# Altium project LM-002-C.PrjPcb
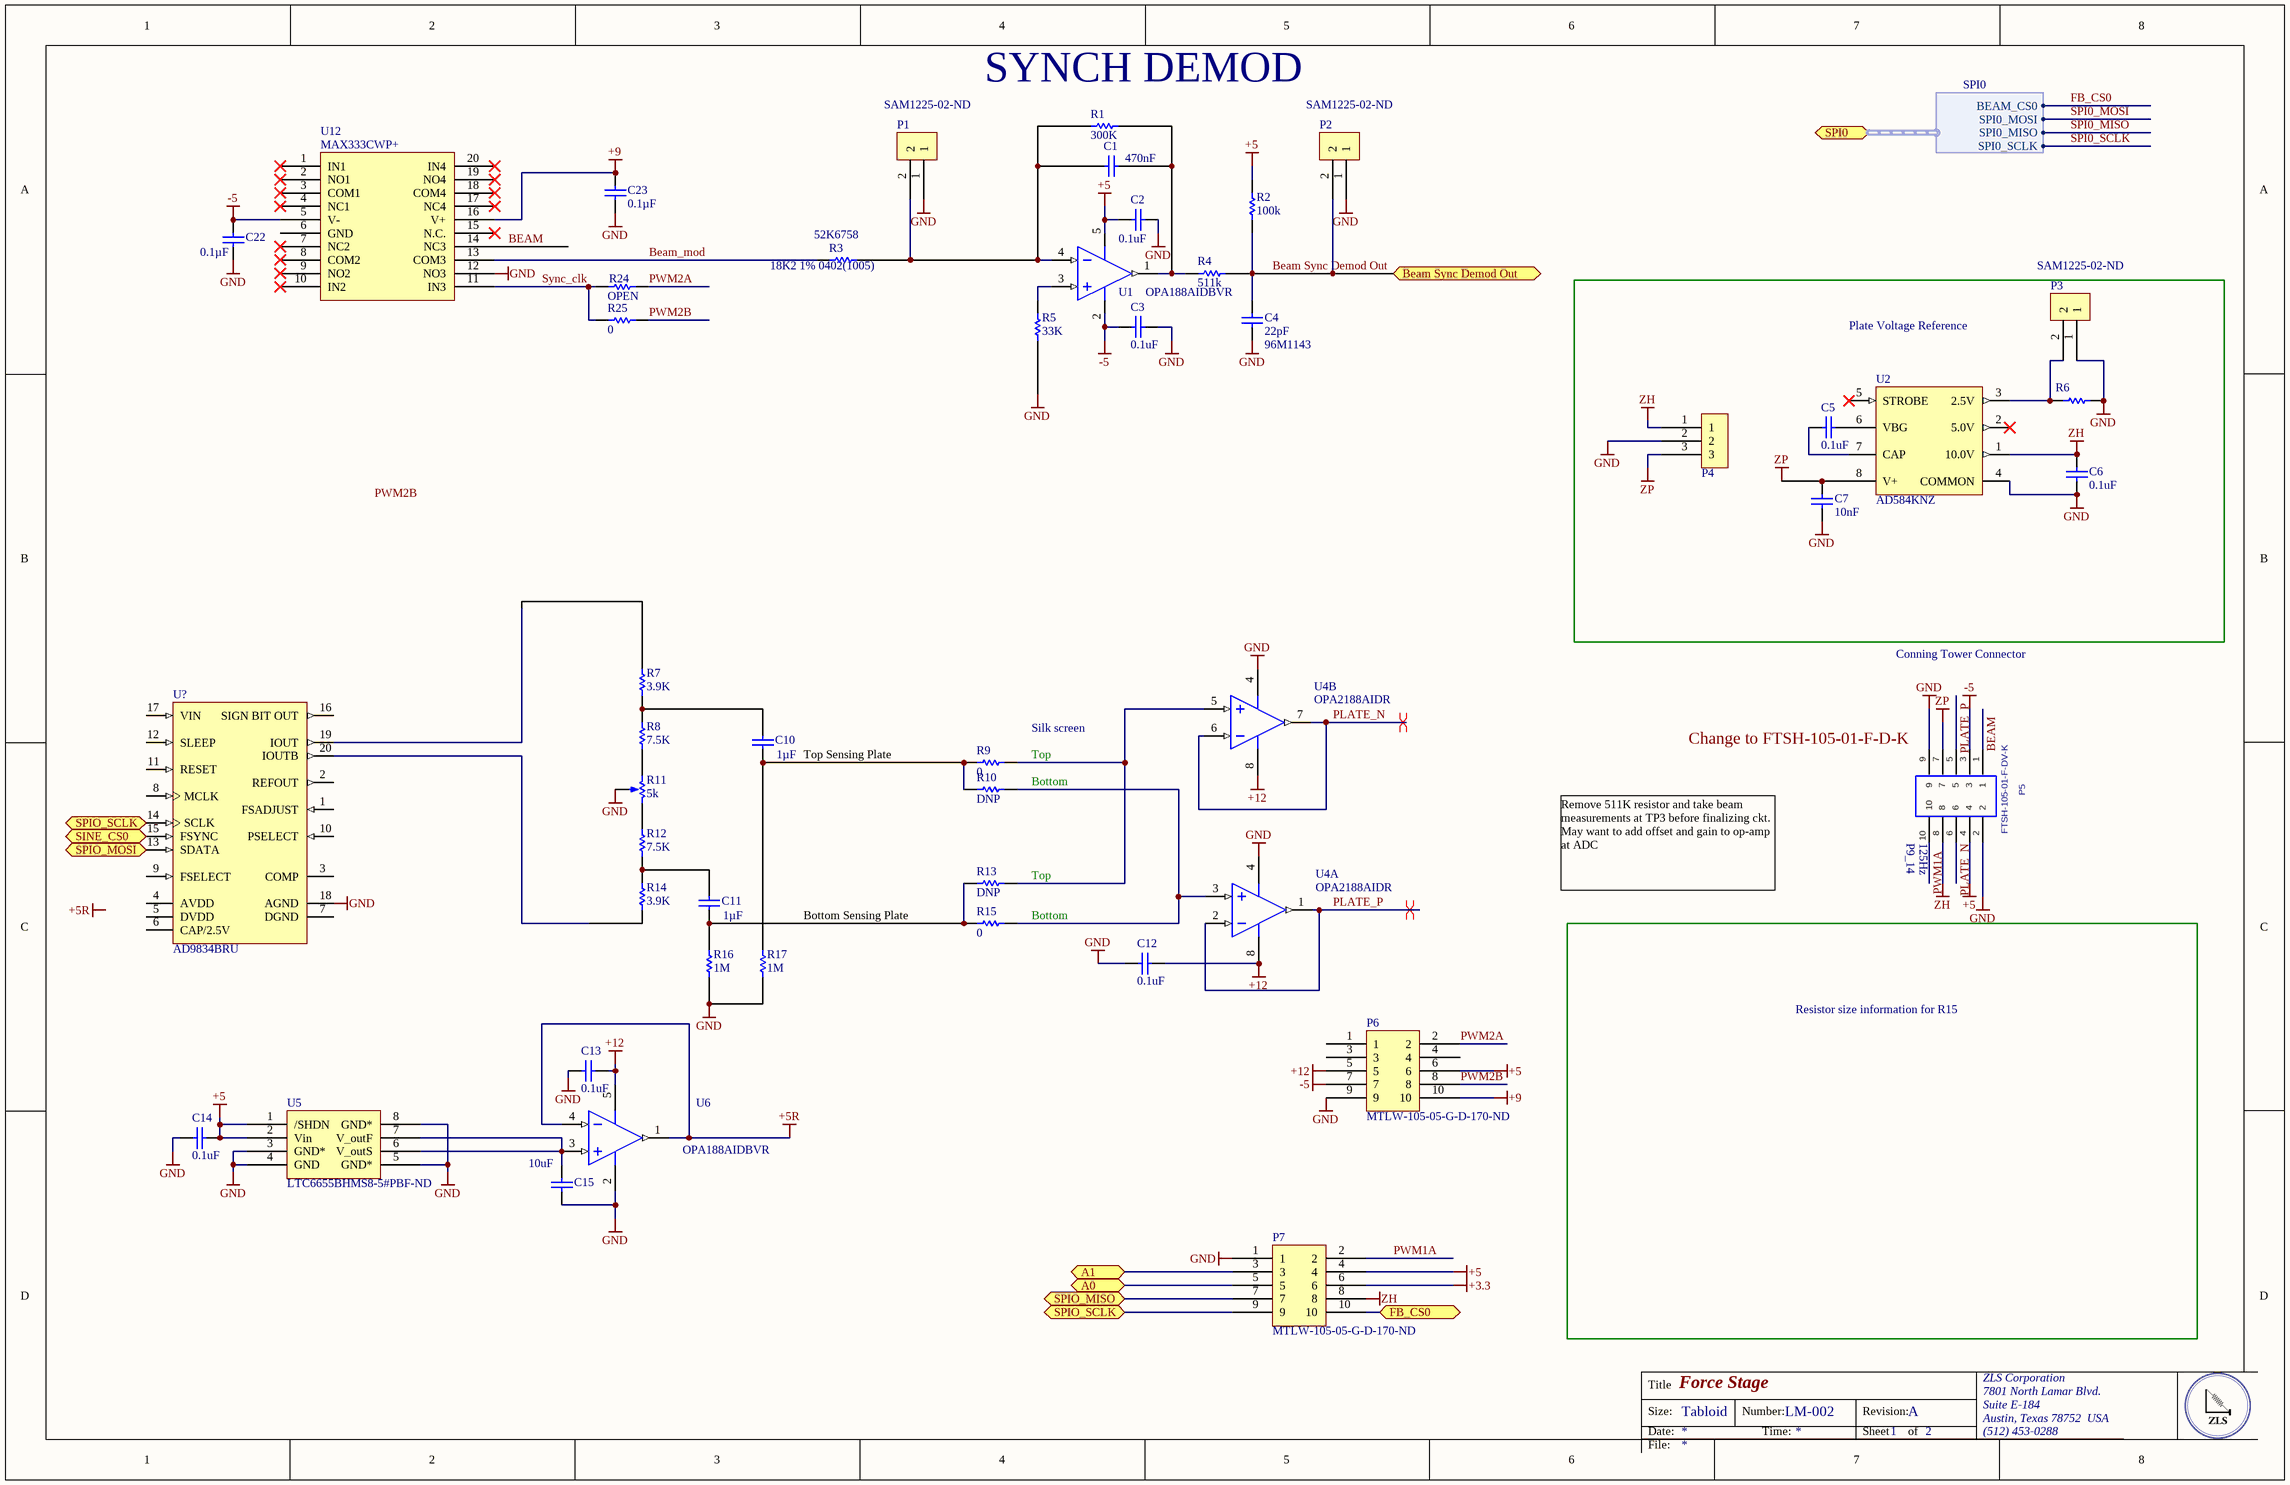
[diagram p0: Sheet1.SchDoc]
4 sheets, 85 parts. Net scope: flat (ports and power ports of the same name join across sheets).
Board file: PCB1.PcbDoc
Sheets:
  Sheet1.SchDoc
  Sheet2.SchDoc
  Sheet3.SchDoc
  Sheet4.SchDoc

## Sheet Sheet1.SchDoc: Force Stage
size Tabloid; DocumentNumber: LM-002; Revision: A; SheetNumber: 1; SheetTotal: 2; DocumentName: LM-002; ProjectName: LM-002

### Parts
C1  Capacitance: 470nF  [CAPC0402(1005)60_L]
C2  0.1uF  [CAPC0402(1005)60_L]
C3  0.1uF  [CAPC0402(1005)60_L]
C4  22pF  Supplier Part Number 1: 96M1143  [CAPC0402(1005)60_L]
C5  0.1uF  [CAPC0402(1005)60_L]
C6  0.1uF  [CAPC0402(1005)60_L]
C7  Capacitance: 10nF  [CAPC0805(2012)145_N]  (hidden comment: Multilayer Ceramic Capacitors MLCC - SMD/SMT 0.01uF 50volts 10% X7R)
C10  Capacitance: 1µF  [CAPC0805(2012)155_L]  (hidden comment: CAP CER 1UF 25V X7R 0805)
C11  Capacitance: 1µF  [CAPC0805(2012)155_L]  (hidden comment: CAP CER 1UF 25V X7R 0805)
C12  0.1uF  [CAPC0402(1005)60_L]
C13  0.1uF  [CAPC0402(1005)60_L]
C14  0.1uF  [CAPC0402(1005)60_L]
C15  value 10uF  [CAPC1812(4532)250_N]  (hidden comment: CAP FILM 10UF 20% 16VDC 1812)
C22  Capacitance: 0.1µF  [CAPC0805(2012)145_N]  (hidden comment: CAP CER 0.1UF 25V X7R 0805)
C23  Capacitance: 0.1µF  [CAPC0805(2012)145_N]  (hidden comment: CAP CER 0.1UF 25V X7R 0805)
P1  Supplier Part Number 1: SAM1225-02-ND  [SSW-102-02-G-S-RA]  (hidden comment: SSW-102-02-G-S-RA)
P2  Supplier Part Number 1: SAM1225-02-ND  [SSW-102-02-G-S-RA]  (hidden comment: SSW-102-02-G-S-RA)
P3  Supplier Part Number 1: SAM1225-02-ND  [SSW-102-02-G-S-RA]  (hidden comment: SSW-102-02-G-S-RA)
P4  SSW-103-02-G-S-RA  [SSW-103-02-G-S-RA]  (value not drawn)
P5  FTSH-105-01-F-DV-K  [FTSH-105-01-XXX-D-K]
P6  Supplier Part Number 1: MTLW-105-05-G-D-170-ND  [TLW-105-05-G-D]  (hidden comment: TLW-105-05-G-D)
P7  Supplier Part Number 1: MTLW-105-05-G-D-170-ND  [TLW-105-05-G-D]  (hidden comment: TLW-105-05-G-D)
R1  300K  [RESC0402(1005)_M]
R2  100k  [RESC0402(1005)_M]
R3  18K2 1% 0402(1005)  Supplier Part Number 1: 52K6758  [RESC0402(1005)_M]
R4  511k  [RESC0402(1005)_M]
R5  33K  [RESC0402(1005)_M]
R6  TBD  [VH102K]  (value not drawn)
R7  3.9K  [RESC0402(1005)_M]
R8  7.5K  [RESC0402(1005)_M]
R9  0  [RESC0402(1005)_M]
R10  DNP  [RESC0402(1005)_M]
R11  Resistance (Ohms): 5k  [Trimmer 2.54]  (hidden comment: TRIMMER 5K OHM 0.25W PC PIN)
R12  7.5K  [RESC0402(1005)_M]
R13  DNP  [RESC0402(1005)_M]
R14  3.9K  [RESC0402(1005)_M]
R15  0  [RESC0402(1005)_M]
R16  1M  [RESC0402(1005)_M]
R17  1M  [RESC0402(1005)_M]
R24  OPEN  [RESC0402(1005)_M]
R25  0  [RESC0402(1005)_M]
U1  OPA188AIDBVR  [DBV0005A_M]
U2  AD584KNZ  [ADI-N-8]
U4  OPA2188AIDR  [D0008A_L]  (parts A,B of 2)
U5  Supplier Part Number 1: LTC6655BHMS8-5#PBF-ND  [TSOP65P490X110-8N]  (hidden comment: LTC6655BHMS8-5#PBF)
U6  OPA188AIDBVR  [DBV0005A_M]
U12  MAX333CWP+  [TSOP65P640X90-20N]
U?  AD9834BRU  [ADI-RU-20_N]

### Blocks framed on the sheet
Plate Voltage Reference: C5-C7 P3 P4 R6 U2

### Ports
A0, A1, Beam Sync Demod Out, FB_CS0, SINE_CS0, SPI0 (harness SPI0), SPIO_MISO, SPIO_MOSI, SPIO_SCLK

### Harnesses
SPI0: BEAM_CS0, SPI0_MOSI, SPI0_MISO, SPI0_SCLK

### Nets
+3.3: P7.6
+5: C2.1 C14.2 P5.4 P6.6 P7.4 R2.2 U1.5(V+) U5.1(/SHDN) U5.2(Vin)
+5R: U6.1(OUT) U6.4(IN-)
+9: C23.2 P6.10 U12.16(V+)
+12: C12.2 C13.2 P6.5 U4.8(V+) U6.5(V+)
-5: C3.1 C22.1 P5.3 P6.7 U1.2(V-) U12.5(V-)
GND: C2.2 C3.2 C4.1 C6.1 C7.2 C12.1 C13.1 C14.1 C15.1 C22.2 C23.1 P1.1 P2.1 P3.1 P4.2 P5.2 P5.9 P6.9 P7.1 R5.1 R6.2 R11.2(b) R16.1 R17.1 U2.4(COMMON) U4.4(V-) U5.3(GND*) U5.4(GND) U5.5(GND*) U5.8(GND*) U6.2(V-) U12.12(NO3) U?.18(AGND)
ZH: C6.2 P4.1 P5.8 P7.8 U2.1(10.0V)
ZP: C7.1 P4.3 P5.7 U2.8(V+)
BEAM: P5.1 U12.14(NC3)
Beam Sync Demod Out: C4.2 P2.2 R2.1 R4.2 ; port Beam Sync Demod Out
Beam_mod: R3.1 U12.13(COM3)
FB_CS0: port SPI0.BEAM_CS0
PLATE_N: P5.6 U4.6(IN_B-) U4.7(OUT_B)
PLATE_P: P5.5 U4.1(OUT_A) U4.2(IN_A-)
PWM1A: P5.10 P7.2
PWM2A: P6.2 R24.1
PWM2B: P6.8 R25.1
SPI0_MISO: port SPI0.SPI0_MISO
SPI0_MOSI: port SPI0.SPI0_MOSI
SPI0_SCLK: port SPI0.SPI0_SCLK
Sync_clk: R24.2 R25.2 U12.11(IN3)
NetC1_1: C1.1 P1.2 R1.1 R3.2 U1.4(IN-)
NetC1_2: C1.2 R1.2 R4.1 U1.1(OUT)
NetC5_1: C5.1 U2.7(CAP)
NetC5_2: C5.2 U2.6(VBG)
NetC10_1: C10.1 R9.2 R10.2 R17.2
NetC10_2: C10.2 R7.1 R8.2
NetC11_1: C11.1 R13.2 R15.2 R16.2
NetC11_2: C11.2 R12.1 R14.2
NetC15_2: C15.2 U5.6(V_outS) U5.7(V_outF) U6.3(IN+)
NetP3_2: P3.2 R6.1 U2.3(2.5V)
NetP7_3: P7.3 ; port A1
NetP7_5: P7.5 ; port A0
NetP7_7: P7.7 ; port SPIO_MISO
NetP7_9: P7.9 U?.14(SCLK) ; port SPIO_SCLK
NetP7_10: P7.10 ; port FB_CS0
NetR5_2: R5.2 U1.3(IN+)
NetR7_2: R7.2 U?.19(IOUT)
NetR8_1: R8.1 R11.1(a)
NetR9_1: R9.1 R13.1 U4.5(IN_B+)
NetR10_1: R10.1 R15.1 U4.3(IN_A+)
NetR11_3: R11.3(c) R12.2
NetR14_1: R14.1 U?.20(IOUTB)
NetU?_13: U?.13(SDATA) ; port SPIO_MOSI
NetU?_15: U?.15(FSYNC) ; port SINE_CS0

Not connected (* = marked no-connect by the designer): P6 1 3 4; U2 2(5.0V)* 5(STROBE)*; U12 1(IN1)* 2(NO1)* 3(COM1)* 4(NC1)* 6(GND) 7(NC2)* 8(COM2)* 9(NO2)* 10(IN2)* 15(N.C.)* 17(NC4)* 18(COM4)* 19(NO4)* 20(IN4)*; U? 1(FSADJUST) 2(REFOUT) 3(COMP) 4(AVDD) 5(DVDD) 6(CAP/2.5V) 7(DGND) 8(MCLK) 9(FSELECT) 10(PSELECT) 11(RESET) 12(SLEEP) 16(SIGN_BIT_OUT) 17(VIN)

### Layout directives
differential pair: PLATE_N, PLATE_P

### Notes on the sheet
- (near R1) SYNCH DEMOD
- Conning Tower Connector
- (near C10) Top Sensing Plate
- Silk screen
- Top
- (near P5) Change to FTSH-105-01-F-D-K
- Bottom
- (near P5) P9_14
- (near P5) 125Hz
- (near R13) Top
- Remove 511K resistor and take beam measurements at TP3 before finalizing ckt.
  May want to add offset and gain to op-amp at ADC
- Bottom Sensing Plate
- Resistor size information for R15
- Labels drawn without touching a wire or pin: +5R, PWM2B
- Title
- Size:
- Date:
- Tabloid
- Number:
- Time:
- Revision:
- Sheet
- of
- ZLS Corporation
- 7801 North Lamar Blvd.
- Suite E-184
- Austin, Texas 78752  USA
- (512) 453-0288
- File:

### Library data of the parts
C1 = CMP-1034-01343-1: Manufacturer: TDK; Manufacturer Part Number: C1005X5R1E474M050BB; Dielectric Material: Ceramic; Tolerance: 20%; Voltage Rating: 25V; Dielectric: X5R; Supplier 1: Mouser; Supplier Part Number 1: 810-C1005X5R1E474M; Stock 1: 40105; Pricing 1: 1=0.15, 10=0.101, 50=0.101, 100=0.04, 1000=0.028, 10000=0.023 (USD); Mount: Surface Mount; Case/Package: 0402; Weight: 2.3E-05oz; Case Code (Metric): 1005; Case Code (Imperial): 0402; Min Operating Temperature: -55°C; Max Operating Temperature: 85°C; Package Quantity: 10000; Packaging: Tape and Reel; Voltage Rating (DC): 25V; Termination: SMD/SMT; Composition: Ceramic; Length: 1mm; Height: 0.5mm; Width: 0.02inch; Depth: 0.5mm; Thickness: 500um; Radiation Hardening: No; REACH SVHC: No SVHC; Lead Free: Lead Free; ComponentLink1URL: https://datasheet.ciiva.com/26870/getdatasheetpartid-753870-26870164.pdf; ComponentLink1Description: https://datasheet.ciiva.com/26870/getdatasheetpartid-753870-26870164.pdf; ComponentLink2URL: https://datasheet.ciiva.com/24219/mlcc-commercial-general-en-24219290.pdf; ComponentLink2Description: https://datasheet.ciiva.com/24219/mlcc-commercial-general-en-24219290.pdf
C2 C3 C5 C6 C12-C14 = CMP-1034-00252-1: CAP CER 0.1UF 10V X7R 0402; Manufacturer: Murata Electronics North America; Manufacturer Part Number: GRM155R71A104KA01D; Tolerance: ±10%; Supplier 1: Digi-Key; Supplier Part Number 1: 490-6321-1-ND; RoHS: RoHS Compliant; Category: Capacitors; Stock 1: 2920395; Pricing 1: 1=0.1, 10=0.014, 100=0.0063, 500=0.00446, 1000=0.00351, 2500=0.00319, 5000=0.00293 (USD); Packaging: Cut Tape (CT); Part Status: Active; Voltage - Rated: 10V; Temperature Coefficient: X7R; Operating Temperature: -55°C ~ 125°C; Features: -; Ratings: -; Applications: General Purpose; Mounting Type: Surface Mount, MLCC; Package / Case: 0402 (1005 Metric); Size / Dimension: 0.039" L x 0.020" W (1.00mm x 0.50mm); Height - Seated (Max): -; Thickness (Max): 0.022" (0.55mm); Lead Spacing: -; ComponentLink1URL: http://www.murata.com/~/media/webrenewal/support/library/catalog/products/capacitor/mlcc/c02e.ashx?la=en-us; ComponentLink1Description: http://www.murata.com/~/media/webrenewal/support/library/catalog/products/capacitor/mlcc/c02e.ashx?la=en-us
C4 = CMP-1034-01343-1: Manufacturer: AVX; Manufacturer Part Number: 04025A220JAT2A; Ceramic Capacitor Case: 0402 [1005 Metric]; Voltage Rating: 50; Capacitance Tolerance: 5%; Dielectric Characteristic: C0G / NP0; Supplier 1: Newark; RoHS: YES; Stock 1: 239391; Pricing 1: 1=0.003, 25=0.003, 100=0.003, 250=0.003, 500=0.003, 1000=0.003, 2500=0.003 (USD); Capacitance: 22pF; Product Range: -; Packaging: Cut Tape; ComponentLink1URL: http://www.farnell.com/datasheets/2068140.pdf; ComponentLink1Description: http://www.farnell.com/datasheets/2068140.pdf
C7 = CMP-1036-04795-1: Manufacturer: Kemet; Manufacturer Part Number: C0805C103K5RACAUTO; Voltage Rating: 50V; Supplier 1: Digi-Key; Supplier Part Number 1: 399-6924-1-ND; Stock 1: 63236; Pricing 1: 1=0.12, 10=0.087, 100=0.041, 500=0.0287, 1000=0.0238 (USD); Mount: Surface Mount; Case/Package: 0805; Case Code (Metric): 2012; Case Code (Imperial): 0805; Dielectric Material: Ceramic; Contact Plating: Tin; Min Operating Temperature: -55°C; Max Operating Temperature: 125°C; Tolerance: 10%; Packaging: Tape and Reel; Package Quantity: 1; Voltage Rating (DC): 50V; Dielectric: X7R; Termination: SMD/SMT; Length: 2mm; Height: 0.78mm; Width: 0.049inch; Thickness: 0.035inch; Depth: 1.25mm; Radiation Hardening: No; REACH SVHC: No SVHC; ComponentLink1URL: https://datasheet.ciiva.com/22700/1693454-22700519.pdf; ComponentLink1Description: https://datasheet.ciiva.com/22700/1693454-22700519.pdf; ComponentLink2URL: https://datasheet.ciiva.com/7842/1693454-7842175.pdf; ComponentLink2Description: https://datasheet.ciiva.com/7842/1693454-7842175.pdf
C10 C11 = CMP-1036-04882-1: Manufacturer: Murata Electronics North America; Manufacturer Part Number: GRM21BR71E105KA99L; Tolerance: ±10%; Supplier 1: Digi-Key; Supplier Part Number 1: 490-6484-6-ND; RoHS: RoHS Compliant; Category: Capacitors; Stock 1: 295074; Pricing 1: 1=0.14, 10=0.099, 100=0.0468, 500=0.0328, 1000=0.02715 (USD); Packaging: Digi-Reel®; Part Status: Active; Voltage - Rated: 25V; Temperature Coefficient: X7R; Operating Temperature: -55°C ~ 125°C; Features: -; Ratings: -; Applications: General Purpose; Mounting Type: Surface Mount, MLCC; Package / Case: 0805 (2012 Metric); Size / Dimension: 0.079" L x 0.049" W (2.00mm x 1.25mm); Height - Seated (Max): -; Thickness (Max): 0.053" (1.35mm); Lead Spacing: -; Lead Style: -; ComponentLink1URL: http://www.murata.com/~/media/webrenewal/support/library/catalog/products/capacitor/mlcc/c02e.ashx; ComponentLink1Description: http://www.murata.com/~/media/webrenewal/support/library/catalog/products/capacitor/mlcc/c02e.ashx
C15 = CMP-1040-01653-1: Manufacturer: Rubycon; Manufacturer Part Number: 16ST106MC44532; Rated Voltage: 16 V; Case-Metric: 4532; Case-EIA: 1812; Tolerance: Â±10%; Voltage Rating - DC: 16V; Dielectric Material: Acrylic, Metallized; Technology: SMT; Max Thickness: 2.5 mm; Supplier 1: Digi-Key; Supplier Part Number 1: 1189-1792-1-ND; RoHS: RoHS Compliant; Category: Capacitors; Stock 1: 1994; Pricing 1: 1=7.05, 10=6.263, 100=5.0105 (USD); Packaging: Cut Tape (CT); Part Status: Active; Voltage Rating - AC: -; Operating Temperature: -55°C ~ 125°C; Mounting Type: Surface Mount; Package / Case: 1812 (4532 Metric); Size / Dimension: 0.177" L x 0.126" W (4.50mm x 3.20mm); Height - Seated (Max): 0.102" (2.60mm); Lead Spacing: -; Applications: DC Link, DC Filtering; Features: -; ComponentLink1URL: http://www.rubycon.co.jp/en/catalog/e_pdfs/pmlcap/e_ST.pdf; ComponentLink1Description: http://www.rubycon.co.jp/en/catalog/e_pdfs/pmlcap/e_ST.pdf
C22 C23 = CMP-1036-04795-1: Manufacturer: Murata Electronics North America; Manufacturer Part Number: GRM21BR71E104KA01L; Tolerance: ±10%; Supplier 1: Digi-Key; Supplier Part Number 1: 490-1673-6-ND; RoHS: RoHS Compliant; Category: Capacitors; Stock 1: 891652; Pricing 1: 1=0.2, 10=0.145, 100=0.0683, 500=0.04788, 1000=0.03964 (USD); Packaging: Digi-Reel®; Part Status: Active; Voltage - Rated: 25V; Temperature Coefficient: X7R; Operating Temperature: -55°C ~ 125°C; Features: -; Ratings: -; Applications: General Purpose; Mounting Type: Surface Mount, MLCC; Package / Case: 0805 (2012 Metric); Size / Dimension: 0.079" L x 0.049" W (2.00mm x 1.25mm); Height - Seated (Max): -; Thickness (Max): 0.053" (1.35mm); Lead Spacing: -; Lead Style: -; ComponentLink1URL: http://www.murata.com/~/media/webrenewal/support/library/catalog/products/capacitor/mlcc/c02e.ashx; ComponentLink1Description: http://www.murata.com/~/media/webrenewal/support/library/catalog/products/capacitor/mlcc/c02e.ashx
P5 = FTSH-105-01-XXX-D-K: TERMINAL STRIP, .050"(1.27mm) PITCH, 10 PINS, KEYING OPTION.; MANUFACTURER: SAMTEC; CREATED: September 26, 2016 - Wendy Xin; PCB DECAL: FTSH-105-01-F-DV-K
P6 P7 = TLW-105-05-G-D: Manufacturer: Samtec Inc.; Manufacturer Part Number: MTLW-105-05-G-D-170; Connector Type: Header; Pitch - Mating: 0.100" (2.54mm); Number of Positions: 10; Number of Positions Loaded: All; Style: Board to Board or Cable; Shrouding: Unshrouded; Contact Length - Mating: 0.170" (4.32mm); Contact Length - Post: 0.105" (2.67mm); Overall Contact Length: 0.335" (8.51mm); Material Flammability Rating: UL94 V-0; Current Rating: 5.2A per Contact; Supplier 1: Digi-Key; RoHS: RoHS Compliant; Category: Connectors, Interconnects; Stock 1: 0; Pricing 1: 1=1.79 (USD); Packaging: Tube; Part Status: Active; Contact Type: Male Pin; Number of Rows: 2; Row Spacing - Mating: 0.100" (2.54mm); Mounting Type: Through Hole; Termination: Solder; Fastening Type: Push-Pull; Insulation Height: 0.060" (1.52mm); Contact Shape: Square; Contact Finish - Mating: Gold; Contact Finish Thickness - Mating: 10µin (0.25µm); Contact Finish - Post: Gold; Contact Material: Phosphor Bronze; Insulation Material: Liquid Crystal Polymer (LCP); Features: -; Operating Temperature: -55°C ~ 125°C; Ingress Protection: -; Insulation Color: Black; Voltage Rating: -; Mated Stacking Heights: -; Contact Finish Thickness - Post: 3µin (0.08µm); Applications: -; ComponentLink1URL: http://suddendocs.samtec.com/prints/mtlw-1xx-xx-xx-x-xxx-xx-xx-mkt1.pdf; ComponentLink1Description: http://suddendocs.samtec.com/prints/mtlw-1xx-xx-xx-x-xxx-xx-xx-mkt1.pdf
R1 R4 R5 R9 R10 R13 R15 R24 R25 = CMP-1011-00651-1
R2 = CMP-1011-00651-1: RES SMD 100K OHM 1% 1/8W 0402; Manufacturer: Vishay Dale; Manufacturer Part Number: CRCW0402100KFKEDHP; Resistance: 100KR; Power Rating: 125mW; Voltage Rating: 50V; Temperature Coefficient: 100ppm/°C; Supplier 1: Avnet; Supplier Part Number 1: CRCW0402100KFKEDHP/BKN; Stock 1: 0; Pricing 1: 1=0.0997, 100=0.0517, 250=0.0516, 500=0.042, 1250=0.0227 (USD); Mount: Surface Mount; Case/Package: 0402; Weight: 2.3E-05oz; Case Code (Metric): 1005; Case Code (Imperial): 0402; Contact Plating: Tin; Min Operating Temperature: -55°C; Max Operating Temperature: 155°C; Tolerance: 1%; Composition: Thick Film; Packaging: Tape and Reel; Voltage Rating (DC): 50V; Package Quantity: 10; Number of Terminations: 2; Termination: SMD/SMT; Max Power Dissipation: 125mW; Length: 1mm; Height: 0.3mm; Width: 0.02inch; Depth: 0.5mm; Radiation Hardening: No; REACH SVHC: Unknown; Lead Free: Lead Free; ComponentLink1URL: https://datasheet.ciiva.com/8982/crcwhpe3-8982553.pdf; ComponentLink1Description: https://datasheet.ciiva.com/8982/crcwhpe3-8982553.pdf; ComponentLink2URL: https://datasheet.ciiva.com/2498/crcwhpe3-2498716.pdf; ComponentLink2Description: https://datasheet.ciiva.com/2498/crcwhpe3-2498716.pdf; ComponentLink3URL: https://datasheet.ciiva.com/2498/crcwhpe3-2498717.pdf; ComponentLink3Description: https://datasheet.ciiva.com/2498/crcwhpe3-2498717.pdf; ComponentLink4URL: https://datasheet.ciiva.com/5548/crcwhpe3-46056-5548557.pdf; ComponentLink4Description: https://datasheet.ciiva.com/5548/crcwhpe3-46056-5548557.pdf; ComponentLink5URL: https://datasheet.ciiva.com/2498/crcwhpe3-2498718.pdf; ComponentLink5Description: https://datasheet.ciiva.com/2498/crcwhpe3-2498718.pdf; ComponentLink6URL: https://datasheet.ciiva.com/48525/crcwhpe3-48525582.pdf; ComponentLink6Description: https://datasheet.ciiva.com/48525/crcwhpe3-48525582.pdf; ComponentLink7URL: https://datasheet.ciiva.com/46441/1703058-46441599.pdf; ComponentLink7Description: https://datasheet.ciiva.com/46441/1703058-46441599.pdf
R3 = CMP-1011-00651-1: 18K2 0.063W 1% 0402 (1005 Metric)  SMD; Manufacturer: VISHAY; Manufacturer Part Number: CRCW040218K2FKED; Resistance: 18.2; Voltage Rating: 50; Resistor Case Style: 0402 [1005 Metric]; Power Rating: 63; Product Range: CRCW Series; No. of Pins: 2; Supplier 1: Newark; RoHS: YESX; Stock 1: 9263; Pricing 1: 1=0.004, 25=0.004, 100=0.004, 250=0.004, 500=0.004, 1000=0.004 (USD); Resistance Tolerance: 1%; Packaging: Cut Tape; ComponentLink1URL: http://www.vishay.com/docs/31543/packsmre.pdf; ComponentLink1Description: http://www.vishay.com/docs/31543/packsmre.pdf; ComponentLink2URL: http://www.farnell.com/cad/1551401.zip; ComponentLink2Description: http://www.farnell.com/cad/1551401.zip; ComponentLink3URL: http://www.farnell.com/datasheets/2111203.pdf?_ga=1.39057253.733356815.1493180800; ComponentLink3Description: http://www.farnell.com/datasheets/2111203.pdf?_ga=1.39057253.733356815.1493180800
R6 = CMP-1013-00393-1
R7 R8 R12 R14 R16 R17 = CMP-1011-00463-1
R11 = Trimmer: Manufacturer: Vishay Foil Resistors (Division of Vishay Precision Group); Manufacturer Part Number: Y00535K00000J0L; Power (Watts): 0.25W, 1/4W; Tolerance: ±5%; Temperature Coefficient: ±10ppm/°C; Number of Turns: 21; Adjustment Type: Side Adjustment; Resistive Material: Metal Foil; Supplier 1: Digi-Key; Supplier Part Number 1: 804-1020-ND; RoHS: RoHS Compliant; Category: Potentiometers, Variable Resistors; Stock 1: 679; Pricing 1: 1=34.42, 10=32.265, 25=26.5292, 50=22.944, 100=22.227, 250=20.793, 500=19.2156 (USD); Packaging: Bulk; Part Status: Active; Mounting Type: Through Hole; Termination Style: PC Pins; Size / Dimension: Rectangular - 0.250" x 0.175" Face x 0.250" L (6.35mm x 4.45mm x 6.35mm); ComponentLink1URL: http://www.vishaypg.com/docs/63053/1240.pdf; ComponentLink1Description: http://www.vishaypg.com/docs/63053/1240.pdf
U1 U6 = CMP-0809-00005-2: Precision, Low Noise, Rail-to-Rail Output, Zero-Drift Operational Amplifier, 4 to 36 V, -40 to 125 degC, 5-pin SOT23 (DBV5), Green (RoHS & no Sb/Br); Manufacturer: Texas Instruments; Total Supply Voltage(Min)(+5V is 5, +/-5V is 10): 4; Offset Drift(Typ)(uV/C): 0.03; Rating: Catalog; SubFamily: Zero Drift Precision Amplifier; GBW(Typ)(MHz): 2; Slew Rate(Typ)(V/us): 0.8; Number of Channels: 1; CMRR(Min)(dB): 120; Iq per channel(Max)(mA): 0.51; Total Supply Voltage(Max)(+5V is 5, +/-5V is 10): 36; PartNumber: OPA188AIDBVR; ComponentLink2Description: Datasheet; ComponentLink2URL: http://www.ti.com/lit/ds/symlink/opa188.pdf; ComponentLink1Description: Manufacturer URL; Mounting Technology: Surface Mount; Eco-Plan: Green (RoHS & no Sb/Br); ComponentLink1URL: http://www.ti.com/; PackageVersion: 4073253-4/K, 03/2006; DatasheetVersion: SBOS642A; ComponentLink3Description: Package Specification; PackageReference: DBV0005A; ComponentLink3URL: http://www.ti.com/litv/pdf/mpds018i; PackageDescription: 5-Pin Plastic Small Outline, Body 1.6 x 2.9 mm, Pitch 0.95 mm; Code_JEDEC: MO-178
U2 = CMP-0784-00054-1: Pin Programmable, Precision Voltage Reference, + 2.5 / + 5 / + 7.5 / + 10 Prog V Output, 4.5 to 30 V Supply, Commercial, 8-pin DIP (N-8), Tube; Manufacturer: Analog Devices; Max V Supply (V): 30; Min V Supply (V): 4.5; Ref Out TC (ppm/C): 15; Vout: 2.5V, 5V, 7.5V, 10V; ComponentLink3URL: http:/www.analog.com/static/imported-files/packages/PKG_PDF/PDIP(N)/N_8.pdf; ComponentLink1URL: http://www.analog.com/en/index.html; PartNumber: AD584KNZ; ComponentLink1Description: Manufacturer URL; ComponentLink2Description: Datasheet; PackageDescription: 8-Pin Plastic Dual In-Line Package, Row spacing 7.62 mm, Pitch 2.54 mm; Operating Temp Range: 0 to 70 degC; DatasheetVersion: Rev. C; Code_JEDEC: MS-001; Packing: Tube; ComponentLink3Description: Package Specification; PackageReference: N-8; ComponentLink4Description: URL Link1; Mounting Technology: Through Hole; PackageVersion: 070606-A, 07/2006; ComponentLink4URL: Product URL:http://www.analog.com/en/special-linear-functions/voltage-references/ad584/products/product.html; ComponentLink2URL: http://www.analog.com/static/imported-files/data_sheets/AD584.pdf
U4 = CMP-0272-00241-3: 0.03 uV/degC, 6 uV Vos, Low Noise, Rail-to-Rail Output, Zero-Drift Operational Amplifier, 4 to 36 V, -40 to 105 degC, 8-pin SOIC (D8), Green (RoHS & no Sb/Br); Manufacturer: Texas Instruments; Number of Circuits: 2; Slew Rate: 0.8 V/µs; Current - Supply: 415µA; Current - Output / Channel: 18mA; Voltage - Supply, Single/Dual (±): 4 V ~ 36 V, ±2 V ~ 18 V; Supplier 1: Digi-Key; Supplier Part Number 1: 296-29454-6-ND; Manufacturer Part Number: OPA2188AIDR; RoHS: RoHS Compliant; Category: Integrated Circuits (ICs); Stock 1: 8272; Pricing 1: 1=3.44, 10=3.089, 100=2.5307, 500=2.15434, 1000=1.81692 (USD); Packaging: Digi-Reel®; Part Status: Active; Amplifier Type: Zero-Drift; Output Type: Rail-to-Rail; -3db Bandwidth: -; Operating Temperature: -40°C ~ 105°C; Mounting Type: Surface Mount; Package / Case: 8-SOIC (0.154", 3.90mm Width); Supplier Device Package: 8-SOIC; ComponentLink1URL: http://www.ti.com/lit/ds/symlink/opa2188.pdf; ComponentLink1Description: http://www.ti.com/lit/ds/symlink/opa2188.pdf
U5 = LTC6655BHMS8-5#PBF: Manufacturer: Linear Technology; Reference Type: Series; Output Type: Fixed; Voltage - Output (Min/Fixed): 5V; Tolerance: ±0.025%; Temperature Coefficient: 2ppm/°C; Noise - 0.1Hz to 10Hz: 0.25ppmp-p; Voltage - Input: 5.5 V ~ 13.2 V; Current - Supply: 7.5mA; Supplier 1: Digi-Key; Manufacturer Part Number: LTC6655BHMS8-5#PBF; RoHS: RoHS Compliant; Category: Integrated Circuits (ICs); Stock 1: 872; Pricing 1: 1=12.29, 25=8.158, 100=6.7 (USD); Packaging: Tube; Part Status: Active; Noise - 10Hz to 10kHz: -; Operating Temperature: -40°C ~ 125°C (TA); Mounting Type: Surface Mount; Package / Case: 8-TSSOP, 8-MSOP (0.118", 3.00mm Width); Supplier Device Package: 8-MSOP; ComponentLink1URL: http://www.linear.com/docs/28576; ComponentLink1Description: http://www.linear.com/docs/28576
U12 = MAX333CWP+: IC SWITCH QUAD SPDT 20TSSOP; Manufacturer: Maxim; Manufacturer Part Number: MAX333AEUP+; Max Supply Voltage: 30V; Min Supply Voltage: 10V; Min Dual Supply Voltage: 4.5V; Max Dual Supply Voltage: 20V; On-State Resistance: 35R; Operating Supply Current: 1uA; Supply Type: Single,Dual; Max Power Dissipation: 559mW; Turn-On Delay Time: 175ns; Turn-Off Delay Time: 145ns; Max Supply Current: 250uA; Number of Bits: 4; Dual Supply Voltage: 15V; Supplier 1: Mouser; Supplier Part Number 1: 700-MAX333AEUP; Stock 1: 664; Pricing 1: 1=6.77, 10=6.43, 50=5.8, 100=5.8, 1000=5.62, 10000=5.62 (USD); Case/Package: TSSOP; Number of Pins: 20; Weight: 0.006737oz; Min Operating Temperature: -40°C; Max Operating Temperature: 85°C; Packaging: Rail/Tube; Package Quantity: 74; Throw Configuration: SPDT; Number of Channels: 4; Length: 6.6mm; Height: 0.95mm; Width: 4.5mm; Radiation Hardening: No; Lead Free: Lead Free; REACH SVHC: Unknown; ComponentLink1URL: https://datasheet.ciiva.com/2978/max333a-2978850.pdf; ComponentLink1Description: https://datasheet.ciiva.com/2978/max333a-2978850.pdf; ComponentLink2URL: https://datasheet.ciiva.com/30478/0900766b81253c85-30478260.pdf; ComponentLink2Description: https://datasheet.ciiva.com/30478/0900766b81253c85-30478260.pdf; ComponentLink3URL: https://datasheet.ciiva.com/1674/max333a-1674617.pdf; ComponentLink3Description: https://datasheet.ciiva.com/1674/max333a-1674617.pdf; ComponentLink4URL: https://datasheet.ciiva.com/26825/max333aeup-26825546.pdf; ComponentLink4Description: https://datasheet.ciiva.com/26825/max333aeup-26825546.pdf
U? = CMP-0293-00068-1: 20 mW Power, 2.3 V to 5.5 V, 75 MHz Complete DDS, 10-Bit, Serial, RU-20, 75 Tube; FS Iout (mA nom): 3mA; REFCLK Multiplier: No; Tuning Word Width (bits): 28bit; Compliance Range (V): 800mV; I Supply total (max): 8.7mA; Resolution (Bits): 10bit; Master fclk: 75MHz; ComponentLink3URL: http://www.analog.com/static/imported-files/packages/364515793657813558433715854054607941441RU20.pdf; ComponentLink2URL: http://www.analog.com/static/imported-files/data_sheets/AD9834.pdf; Code_JEDEC: MO-153AC; PackageVersion: 2000; ComponentLink1URL: www.analog.com; PackageDescription: 20-Lead Thin Shrink Small Outline Package [TSSOP]; ComponentLink1Description: Manufacturer URL; PackageReference: RU-20; DatasheetVersion: Rev. C; ComponentLink3Description: Package Specification; I/O Interface: Serial; ComponentLink2Description: Datasheet
P1-P3 = SSW-102-02-G-S-RA: Supplier 1: Digi-Key

## Sheet Sheet2.SchDoc: Sense Stage
size Tabloid; DocumentNumber: LM-002; Revision: A; SheetNumber: 2; SheetTotal: 2; DocumentName: LM-002
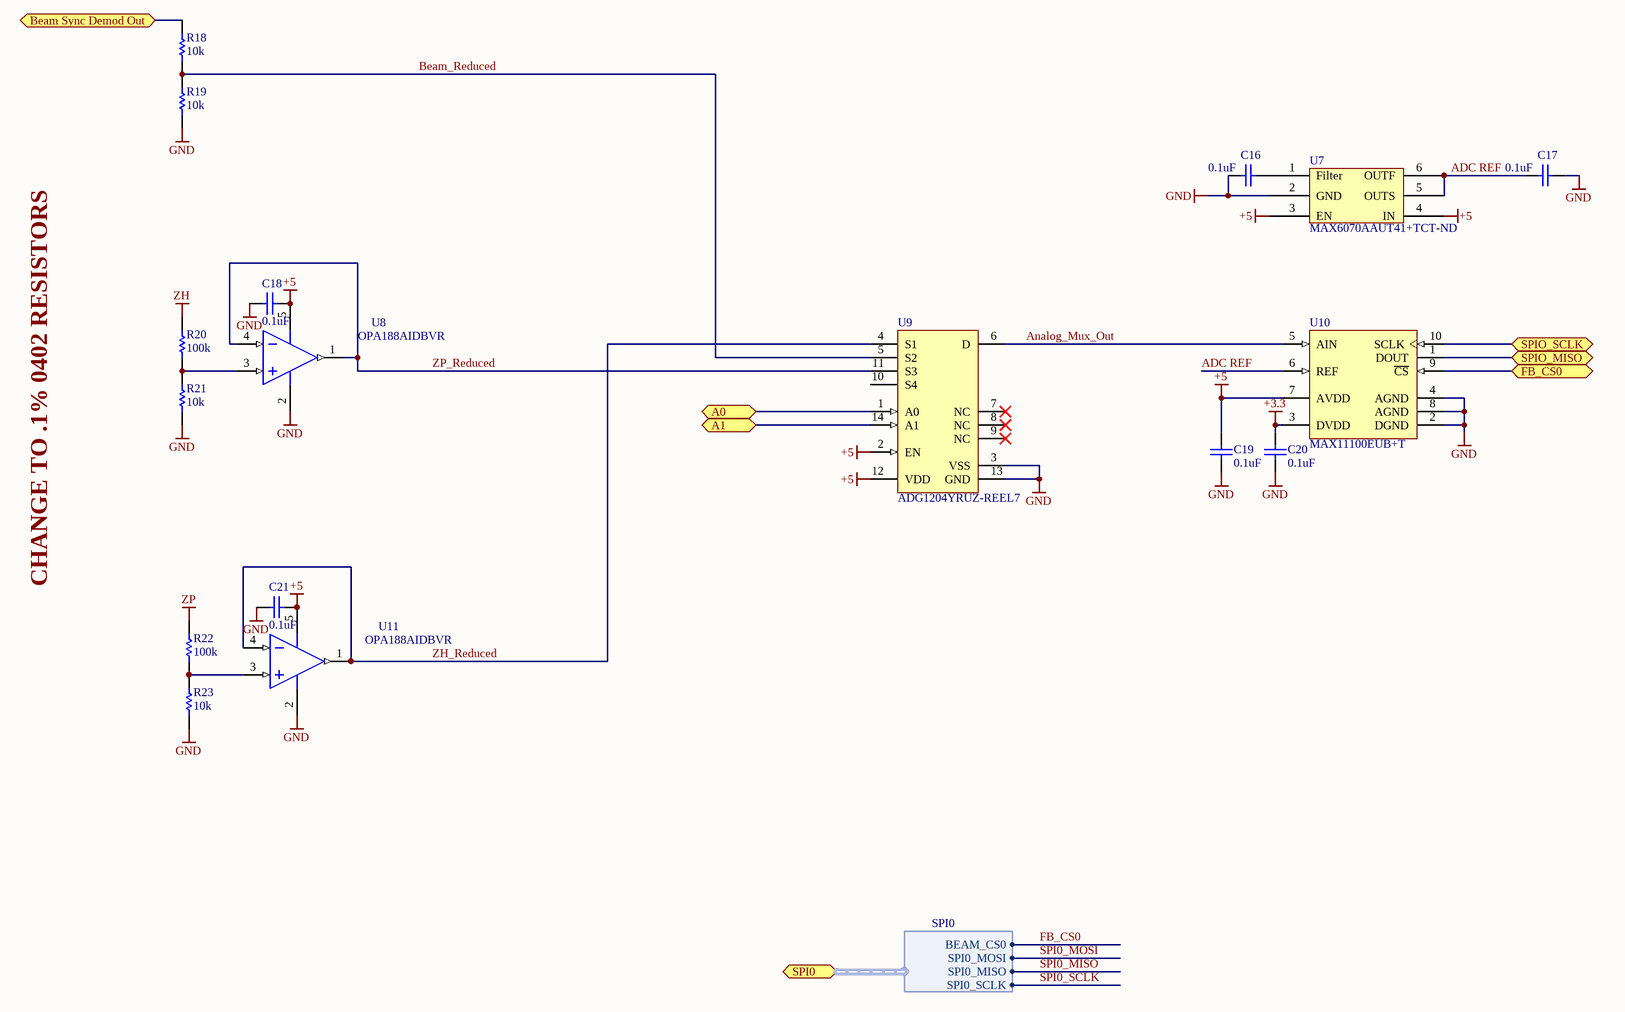
[diagram p1: Sheet2.SchDoc]

### Parts
C16  0.1uF  [CAPC0402(1005)60_L]
C17  0.1uF  [CAPC0402(1005)60_L]
C18  0.1uF  [CAPC0402(1005)60_L]
C19  0.1uF  [CAPC0402(1005)60_L]
C20  0.1uF  [CAPC0402(1005)60_L]
C21  0.1uF  [CAPC0402(1005)60_L]
R18  10k  [RESC0402(1005)_M]
R19  10k  [RESC0402(1005)_M]
R20  100k  [RESC0402(1005)_M]
R21  10k  [RESC0402(1005)_M]
R22  100k  [RESC0402(1005)_M]
R23  10k  [RESC0402(1005)_M]
U7  Supplier Part Number 1: MAX6070AAUT41+TCT-ND  [SOT95P280X445-6N]  (hidden comment: MAX6070AAUT41+T)
U8  OPA188AIDBVR  [DBV0005A_M]
U9  ADG1204YRUZ-REEL7  [ADI-RU-14_L]
U10  MAX11100EUB+T  [U10+2_L]
U11  OPA188AIDBVR  [DBV0005A_M]

### Ports
A0, A1, Beam Sync Demod Out, FB_CS0, SPI0 (harness SPI0), SPIO_MISO, SPIO_SCLK

### Harnesses
SPI0: BEAM_CS0, SPI0_MOSI, SPI0_MISO, SPI0_SCLK

### Nets
+3.3: C20.1 U10.3(DVDD)
+5: C18.2 C19.1 C21.2 U7.3(EN) U7.4(IN) U8.5(V+) U9.2(EN) U9.12(VDD) U10.7(AVDD) U11.5(V+)
GND: C16.2 C17.1 C18.1 C19.2 C20.2 C21.1 R19.1 R21.1 R23.1 U7.2(GND) U8.2(V-) U9.3(VSS) U9.13(GND) U10.2(DGND) U10.4(AGND) U10.8(AGND) U11.2(V-)
ZH: R20.2
ZP: R22.2
ADC REF: C17.2 U7.5(OUTS) U7.6(OUTF) U10.6(REF)
Analog_Mux_Out: U9.6(D) U10.5(AIN)
Beam Sync Demod Out: R18.2 ; port Beam Sync Demod Out
Beam_Reduced: R18.1 R19.2 U9.5(S2)
FB_CS0: port SPI0.BEAM_CS0
SPI0_MISO: port SPI0.SPI0_MISO
SPI0_MOSI: port SPI0.SPI0_MOSI
SPI0_SCLK: port SPI0.SPI0_SCLK
ZH_Reduced: U9.4(S1) U11.1(OUT) U11.4(IN-)
ZP_Reduced: U8.1(OUT) U8.4(IN-) U9.11(S3)
NetC16_1: C16.1 U7.1(Filter)
NetP7_3: U9.14(A1) ; port A1
NetP7_5: U9.1(A0) ; port A0
NetP7_7: U10.1(DOUT) ; port SPIO_MISO
NetP7_9: U10.10(SCLK) ; port SPIO_SCLK
NetP7_10: U10.9(~{CS}) ; port FB_CS0
NetR20_1: R20.1 R21.2 U8.3(IN+)
NetR22_1: R22.1 R23.2 U11.3(IN+)

Not connected (* = marked no-connect by the designer): U9 7(NC)* 8(NC)* 9(NC)* 10(S4)

### Notes on the sheet
- CHANGE TO .1% 0402 RESISTORS
- Title
- Size:
- Date:
- Tabloid
- Number:
- Time:
- Revision:
- Sheet
- of
- ZLS Corporation
- 7801 North Lamar Blvd.
- Suite E-184
- Austin, Texas 78752  USA
- (512) 453-0288
- File:

### Library data of the parts
C16-C21 = CMP-1034-00252-1: as C2 on sheet Sheet1; Supplier 1: Digi-Key; Supplier Part Number 1: 490-6321-1-ND; RoHS: RoHS Compliant; Category: Capacitors; Stock 1: 2920395; Pricing 1: 1=0.1, 10=0.014, 100=0.0063, 500=0.00446, 1000=0.00351, 2500=0.00319, 5000=0.00293 (USD); Packaging: Cut Tape (CT); Part Status: Active; Voltage - Rated: 10V; Temperature Coefficient: X7R; Operating Temperature: -55°C ~ 125°C; Features: -; Ratings: -; Applications: General Purpose; Mounting Type: Surface Mount, MLCC; Package / Case: 0402 (1005 Metric); Size / Dimension: 0.039" L x 0.020" W (1.00mm x 0.50mm); Height - Seated (Max): -; Thickness (Max): 0.022" (0.55mm); Lead Spacing: -; ComponentLink1URL: http://www.murata.com/~/media/webrenewal/support/library/catalog/products/capacitor/mlcc/c02e.ashx?la=en-us; ComponentLink1Description: http://www.murata.com/~/media/webrenewal/support/library/catalog/products/capacitor/mlcc/c02e.ashx?la=en-us
R18 R19 R21 R23 = CMP-1011-00651-1: RES SMD 10K OHM 1% 1/8W 0402; Manufacturer: Vishay Dale; Manufacturer Part Number: CRCW0402100KFKEDHP; Supplier Part Number 1: CRCW0402100KFKEDHP/BKN; Case/Package: 0402; Case Code (Metric): 1005; Case Code (Imperial): 0402; Contact Plating: Tin; Composition: Thick Film; Length: 1mm; Height: 0.3mm; Depth: 0.5mm; Lead Free: Lead Free; ComponentLink1URL: https://datasheet.ciiva.com/8982/crcwhpe3-8982553.pdf; ComponentLink1Description: https://datasheet.ciiva.com/8982/crcwhpe3-8982553.pdf; ComponentLink2URL: https://datasheet.ciiva.com/2498/crcwhpe3-2498716.pdf; ComponentLink2Description: https://datasheet.ciiva.com/2498/crcwhpe3-2498716.pdf; ComponentLink3URL: https://datasheet.ciiva.com/2498/crcwhpe3-2498717.pdf; ComponentLink3Description: https://datasheet.ciiva.com/2498/crcwhpe3-2498717.pdf; ComponentLink4URL: https://datasheet.ciiva.com/5548/crcwhpe3-46056-5548557.pdf; ComponentLink4Description: https://datasheet.ciiva.com/5548/crcwhpe3-46056-5548557.pdf; ComponentLink5URL: https://datasheet.ciiva.com/2498/crcwhpe3-2498718.pdf; ComponentLink5Description: https://datasheet.ciiva.com/2498/crcwhpe3-2498718.pdf; ComponentLink6URL: https://datasheet.ciiva.com/48525/crcwhpe3-48525582.pdf; ComponentLink6Description: https://datasheet.ciiva.com/48525/crcwhpe3-48525582.pdf; ComponentLink7URL: https://datasheet.ciiva.com/46441/1703058-46441599.pdf; ComponentLink7Description: https://datasheet.ciiva.com/46441/1703058-46441599.pdf
R20 R22 = CMP-1011-00651-1: as R2 on sheet Sheet1; Supplier 1: Avnet; Supplier Part Number 1: CRCW0402100KFKEDHP/BKN; Stock 1: 0; Pricing 1: 1=0.0997, 100=0.0517, 250=0.0516, 500=0.042, 1250=0.0227 (USD); Mount: Surface Mount; Case/Package: 0402; Weight: 2.3E-05oz; Case Code (Metric): 1005; Case Code (Imperial): 0402; Contact Plating: Tin; Min Operating Temperature: -55°C; Max Operating Temperature: 155°C; Tolerance: 1%; Composition: Thick Film; Packaging: Tape and Reel; Voltage Rating (DC): 50V; Package Quantity: 10; Number of Terminations: 2; Termination: SMD/SMT; Max Power Dissipation: 125mW; Length: 1mm; Height: 0.3mm; Width: 0.02inch; Depth: 0.5mm; Radiation Hardening: No; REACH SVHC: Unknown; Lead Free: Lead Free; ComponentLink1URL: https://datasheet.ciiva.com/8982/crcwhpe3-8982553.pdf; ComponentLink1Description: https://datasheet.ciiva.com/8982/crcwhpe3-8982553.pdf; ComponentLink2URL: https://datasheet.ciiva.com/2498/crcwhpe3-2498716.pdf; ComponentLink2Description: https://datasheet.ciiva.com/2498/crcwhpe3-2498716.pdf; ComponentLink3URL: https://datasheet.ciiva.com/2498/crcwhpe3-2498717.pdf; ComponentLink3Description: https://datasheet.ciiva.com/2498/crcwhpe3-2498717.pdf; ComponentLink4URL: https://datasheet.ciiva.com/5548/crcwhpe3-46056-5548557.pdf; ComponentLink4Description: https://datasheet.ciiva.com/5548/crcwhpe3-46056-5548557.pdf; ComponentLink5URL: https://datasheet.ciiva.com/2498/crcwhpe3-2498718.pdf; ComponentLink5Description: https://datasheet.ciiva.com/2498/crcwhpe3-2498718.pdf; ComponentLink6URL: https://datasheet.ciiva.com/48525/crcwhpe3-48525582.pdf; ComponentLink6Description: https://datasheet.ciiva.com/48525/crcwhpe3-48525582.pdf; ComponentLink7URL: https://datasheet.ciiva.com/46441/1703058-46441599.pdf; ComponentLink7Description: https://datasheet.ciiva.com/46441/1703058-46441599.pdf
U7 = MAX6070AAUT41+T: IC VREF SERIES 4.096V SOT23; Manufacturer: Maxim Integrated; Output Type: Fixed; Tolerance: ±0.04%; Temperature Coefficient: 6ppm/°C; Noise - 0.1Hz to 10Hz: 9.6µVp-p; Noise - 10Hz to 10kHz: 9µVrms; Voltage - Input: 4.3 V ~ 5.5 V; Current - Supply: 350µA; Supplier 1: Digi-Key; Manufacturer Part Number: MAX6070AAUT41+T; RoHS: RoHS Compliant; Category: Integrated Circuits (ICs); Stock 1: 2623; Pricing 1: 1=3.41, 10=3.213, 25=2.5704, 50=2.4418, 100=2.2491, 250=2.13344, 500=2.05634 (USD); Packaging: Cut Tape (CT); Part Status: Active; Reference Type: Series; Voltage - Output (Min/Fixed): 4.096V; Operating Temperature: -40°C ~ 125°C (TA); Mounting Type: Surface Mount; Package / Case: SOT-23-6; Supplier Device Package: SOT-23-6; ComponentLink1URL: https://datasheets.maximintegrated.com/en/ds/MAX6070-MAX6071.pdf; ComponentLink1Description: https://datasheets.maximintegrated.com/en/ds/MAX6070-MAX6071.pdf
U8 U11 = CMP-0809-00005-2: as U1 on sheet Sheet1; PartNumber: OPA188AIDBVR; ComponentLink2Description: Datasheet; ComponentLink2URL: http://www.ti.com/lit/ds/symlink/opa188.pdf; ComponentLink1Description: Manufacturer URL; Mounting Technology: Surface Mount; Eco-Plan: Green (RoHS & no Sb/Br); ComponentLink1URL: http://www.ti.com/; PackageVersion: 4073253-4/K, 03/2006; DatasheetVersion: SBOS642A; ComponentLink3Description: Package Specification; PackageReference: DBV0005A; ComponentLink3URL: http://www.ti.com/litv/pdf/mpds018i; PackageDescription: 5-Pin Plastic Small Outline, Body 1.6 x 2.9 mm, Pitch 0.95 mm; Code_JEDEC: MO-178
U9 = CMP-0793-00109-1: Low Capacitance, Low Charge Injection, +/-15 V / +12 V, 4:1 iCMOS Multiplexer, 120 Ohm Ron, 14-pin SOP (RU-14), Reel; Manufacturer: Analog Devices; t transition (s): 120n; Max Analog Signal Range: Vss to Vdd; Bandwidth (Hz): 800M, 550M; Ron (ohms): 120; Packing: Reel; Mounting Technology: Surface Mount; PackageVersion: Aug-02; PackageDescription: 14-Pin Thin Shrink Small Outline Package, Body 5 x 4.4 mm, Pitch 0.65 mm; Code_JEDEC: MO-153AB-1; ComponentLink3Description: Package Specification; ComponentLink2URL: http://www.analog.com/static/imported-files/data_sheets/ADG1204.pdf; ComponentLink1URL: http://www.analog.com/en/index.html; PackageReference: RU-14; DatasheetVersion: Rev. B; ComponentLink3URL: http://www.analog.com/static/imported-files/packages/36057385283879153717235186773RU14.pdf; ComponentLink1Description: Manufacturer URL; PartNumber: ADG1204YRUZ-REEL7; ComponentLink2Description: Datasheet
U10 = CMP-0249-00017-1: 16-Bit, +5V, 200ksps ADC with 10uA Shutdown, 10-Pin uMAX, -40°C to +85°C, Pb-Free, Tape and Reel; DatasheetVersion: Rev 1, Jan-2012; ComponentLink3URL: http://pdfserv.maxim-ic.com/package_dwgs/21-0061.PDF; PackageReference: U10+2; ComponentLink2URL: http://datasheets.maxim-ic.com/en/ds/MAX11100.pdf; PackageVersion: revL, 2008; ComponentLink1Description: Manufacturer URL; Code_JEDEC: MO-187-BA; ComponentLink1URL: http://www.maxim-ic.com; ComponentLink3Description: Package Specification; PackageDescription: 10-Pin Micro-MAX Thin Shrink Small Outline (uSOP), 3 x 3 x 0.85 mm Body, 0.5 mm Pitch, Pb-Free; ComponentLink2Description: Datasheet

## Sheet Sheet3.SchDoc
size OrCAD A
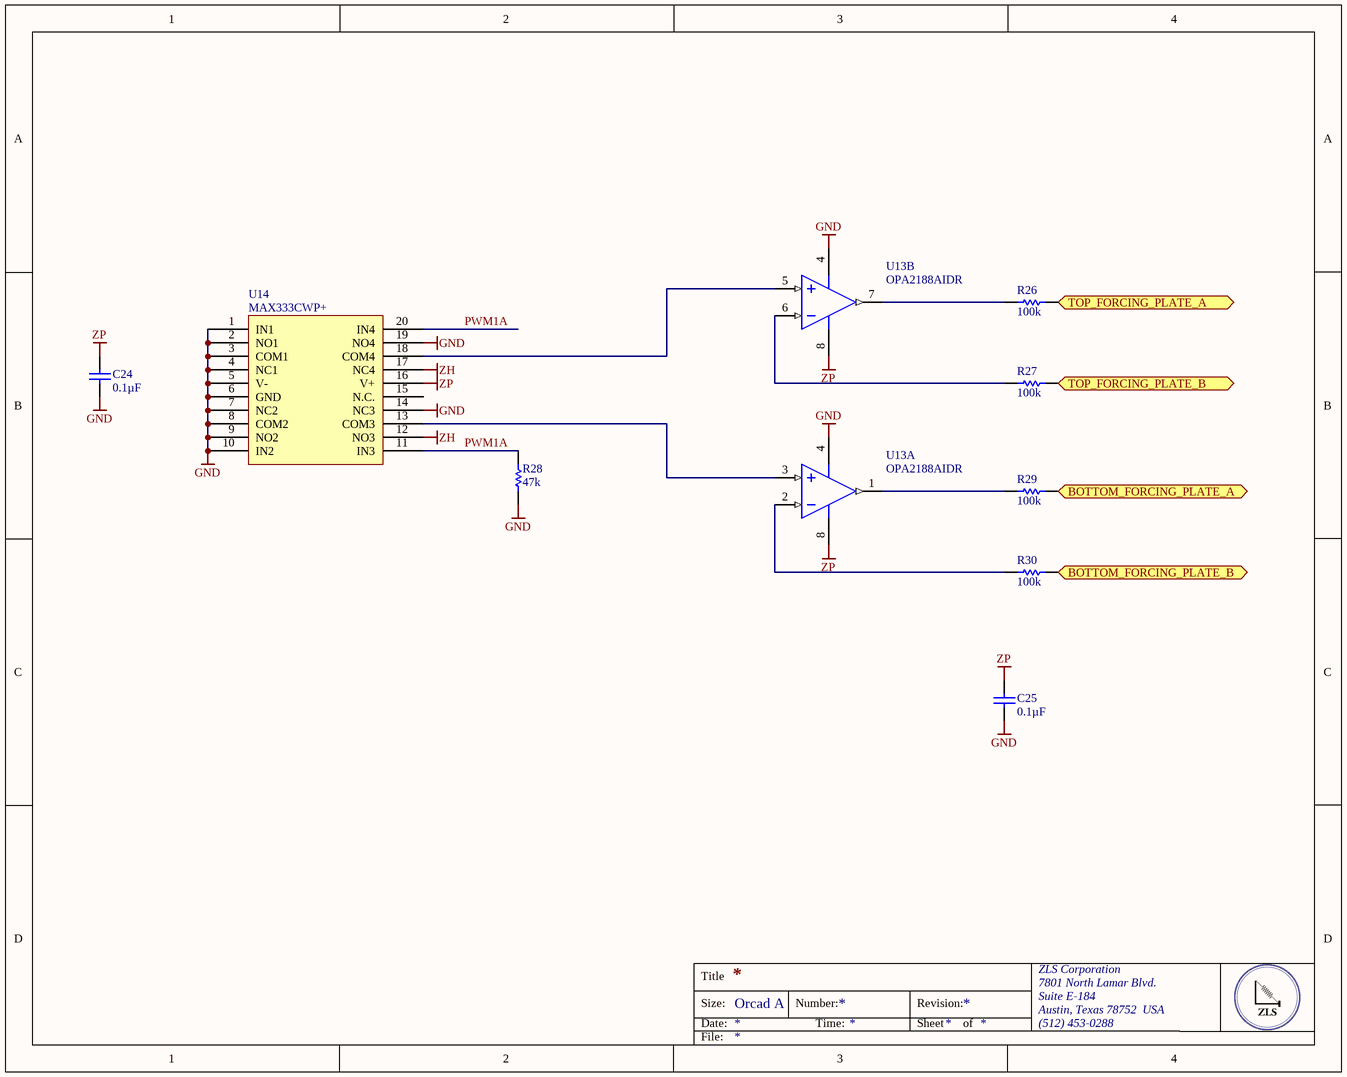
[diagram p2: Sheet3.SchDoc]

### Parts
C24  Capacitance: 0.1µF  [CAPC0805(2012)145_N]  (hidden comment: CAP CER 0.1UF 25V X7R 0805)
C25  Capacitance: 0.1µF  [CAPC0805(2012)145_N]  (hidden comment: CAP CER 0.1UF 25V X7R 0805)
R26  100k  [RESC0402(1005)_M]
R27  100k  [RESC0402(1005)_M]
R28  47k  [RESC0402(1005)_M]
R29  100k  [RESC0402(1005)_M]
R30  100k  [RESC0402(1005)_M]
U13  OPA2188AIDR  [D0008A_L]  (parts A,B of 2)
U14  MAX333CWP+  [TSOP65P640X90-20N]

### Ports
BOTTOM_FORCING_PLATE_A, BOTTOM_FORCING_PLATE_B, TOP_FORCING_PLATE_A, TOP_FORCING_PLATE_B

### Nets
GND: C24.1 C25.1 R28.1 U13.4(V-) U14.1(IN1) U14.2(NO1) U14.3(COM1) U14.4(NC1) U14.5(V-) U14.6(GND) U14.7(NC2) U14.8(COM2) U14.9(NO2) U14.10(IN2) U14.14(NC3) U14.19(NO4)
ZH: U14.12(NO3) U14.17(NC4)
ZP: C24.2 C25.2 U13.8(V+) U14.16(V+)
PWM1A: R28.2 U14.11(IN3) U14.20(IN4)
NetR26_1: R26.1 ; port TOP_FORCING_PLATE_A
NetR26_2: R26.2 U13.7(OUT_B)
NetR27_1: R27.1 ; port TOP_FORCING_PLATE_B
NetR27_2: R27.2 U13.6(IN_B-)
NetR29_1: R29.1 ; port BOTTOM_FORCING_PLATE_A
NetR29_2: R29.2 U13.1(OUT_A)
NetR30_1: R30.1 ; port BOTTOM_FORCING_PLATE_B
NetR30_2: R30.2 U13.2(IN_A-)
NetU13_3: U13.3(IN_A+) U14.13(COM3)
NetU13_5: U13.5(IN_B+) U14.18(COM4)

Not connected (* = marked no-connect by the designer): U14 15(N.C.)

### Notes on the sheet
- Title
- Size:
- Date:
- Orcad A
- Number:
- Time:
- Revision:
- Sheet
- of
- ZLS Corporation
- 7801 North Lamar Blvd.
- Suite E-184
- Austin, Texas 78752  USA
- (512) 453-0288
- File:

### Library data of the parts
C24 C25 = CMP-1036-04795-1: as C22 on sheet Sheet1; Supplier 1: Digi-Key; Supplier Part Number 1: 490-1673-6-ND; RoHS: RoHS Compliant; Category: Capacitors; Stock 1: 891652; Pricing 1: 1=0.2, 10=0.145, 100=0.0683, 500=0.04788, 1000=0.03964 (USD); Packaging: Digi-Reel®; Part Status: Active; Voltage - Rated: 25V; Temperature Coefficient: X7R; Operating Temperature: -55°C ~ 125°C; Features: -; Ratings: -; Applications: General Purpose; Mounting Type: Surface Mount, MLCC; Package / Case: 0805 (2012 Metric); Size / Dimension: 0.079" L x 0.049" W (2.00mm x 1.25mm); Height - Seated (Max): -; Thickness (Max): 0.053" (1.35mm); Lead Spacing: -; Lead Style: -; ComponentLink1URL: http://www.murata.com/~/media/webrenewal/support/library/catalog/products/capacitor/mlcc/c02e.ashx; ComponentLink1Description: http://www.murata.com/~/media/webrenewal/support/library/catalog/products/capacitor/mlcc/c02e.ashx
R26-R30 = CMP-1011-00651-1: as R18 on sheet Sheet2; Supplier Part Number 1: CRCW0402100KFKEDHP/BKN; Case/Package: 0402; Case Code (Metric): 1005; Case Code (Imperial): 0402; Contact Plating: Tin; Composition: Thick Film; Length: 1mm; Height: 0.3mm; Depth: 0.5mm; Lead Free: Lead Free; ComponentLink1URL: https://datasheet.ciiva.com/8982/crcwhpe3-8982553.pdf; ComponentLink1Description: https://datasheet.ciiva.com/8982/crcwhpe3-8982553.pdf; ComponentLink2URL: https://datasheet.ciiva.com/2498/crcwhpe3-2498716.pdf; ComponentLink2Description: https://datasheet.ciiva.com/2498/crcwhpe3-2498716.pdf; ComponentLink3URL: https://datasheet.ciiva.com/2498/crcwhpe3-2498717.pdf; ComponentLink3Description: https://datasheet.ciiva.com/2498/crcwhpe3-2498717.pdf; ComponentLink4URL: https://datasheet.ciiva.com/5548/crcwhpe3-46056-5548557.pdf; ComponentLink4Description: https://datasheet.ciiva.com/5548/crcwhpe3-46056-5548557.pdf; ComponentLink5URL: https://datasheet.ciiva.com/2498/crcwhpe3-2498718.pdf; ComponentLink5Description: https://datasheet.ciiva.com/2498/crcwhpe3-2498718.pdf; ComponentLink6URL: https://datasheet.ciiva.com/48525/crcwhpe3-48525582.pdf; ComponentLink6Description: https://datasheet.ciiva.com/48525/crcwhpe3-48525582.pdf; ComponentLink7URL: https://datasheet.ciiva.com/46441/1703058-46441599.pdf; ComponentLink7Description: https://datasheet.ciiva.com/46441/1703058-46441599.pdf
U13 = CMP-0272-00241-3: as U4 on sheet Sheet1; Supplier 1: Digi-Key; Supplier Part Number 1: 296-29454-6-ND; Manufacturer Part Number: OPA2188AIDR; RoHS: RoHS Compliant; Category: Integrated Circuits (ICs); Stock 1: 8272; Pricing 1: 1=3.44, 10=3.089, 100=2.5307, 500=2.15434, 1000=1.81692 (USD); Packaging: Digi-Reel®; Part Status: Active; Amplifier Type: Zero-Drift; Output Type: Rail-to-Rail; -3db Bandwidth: -; Operating Temperature: -40°C ~ 105°C; Mounting Type: Surface Mount; Package / Case: 8-SOIC (0.154", 3.90mm Width); Supplier Device Package: 8-SOIC; ComponentLink1URL: http://www.ti.com/lit/ds/symlink/opa2188.pdf; ComponentLink1Description: http://www.ti.com/lit/ds/symlink/opa2188.pdf
U14 = MAX333CWP+: as U12 on sheet Sheet1; Supplier 1: Mouser; Supplier Part Number 1: 700-MAX333AEUP; Stock 1: 664; Pricing 1: 1=6.77, 10=6.43, 50=5.8, 100=5.8, 1000=5.62, 10000=5.62 (USD); Case/Package: TSSOP; Number of Pins: 20; Weight: 0.006737oz; Min Operating Temperature: -40°C; Max Operating Temperature: 85°C; Packaging: Rail/Tube; Package Quantity: 74; Throw Configuration: SPDT; Number of Channels: 4; Length: 6.6mm; Height: 0.95mm; Width: 4.5mm; Radiation Hardening: No; Lead Free: Lead Free; REACH SVHC: Unknown; ComponentLink1URL: https://datasheet.ciiva.com/2978/max333a-2978850.pdf; ComponentLink1Description: https://datasheet.ciiva.com/2978/max333a-2978850.pdf; ComponentLink2URL: https://datasheet.ciiva.com/30478/0900766b81253c85-30478260.pdf; ComponentLink2Description: https://datasheet.ciiva.com/30478/0900766b81253c85-30478260.pdf; ComponentLink3URL: https://datasheet.ciiva.com/1674/max333a-1674617.pdf; ComponentLink3Description: https://datasheet.ciiva.com/1674/max333a-1674617.pdf; ComponentLink4URL: https://datasheet.ciiva.com/26825/max333aeup-26825546.pdf; ComponentLink4Description: https://datasheet.ciiva.com/26825/max333aeup-26825546.pdf

## Sheet Sheet4.SchDoc
size OrCAD A
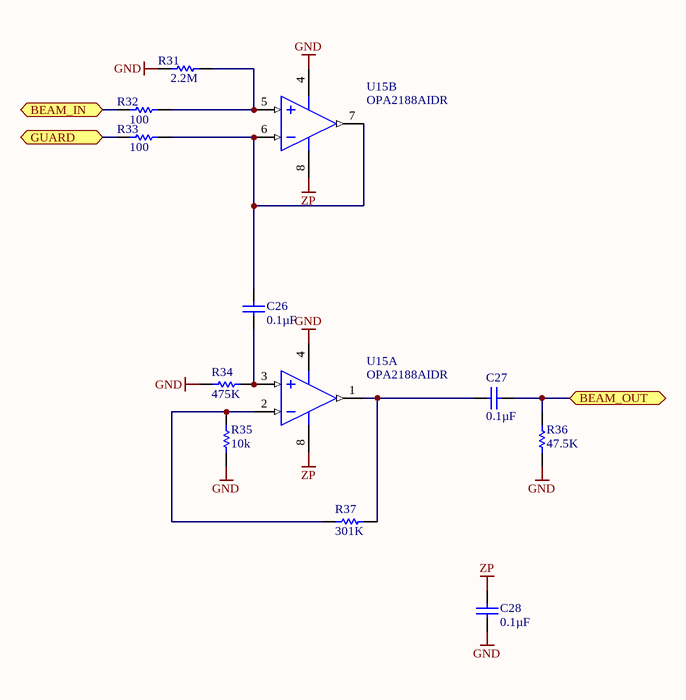
[diagram p3: Sheet4.SchDoc]

### Parts
C26  Capacitance: 0.1µF  [CAPC0805(2012)145_N]  (hidden comment: CAP CER 0.1UF 25V X7R 0805)
C27  Capacitance: 0.1µF  [CAPC0805(2012)145_N]  (hidden comment: CAP CER 0.1UF 25V X7R 0805)
C28  Capacitance: 0.1µF  [CAPC0805(2012)145_N]  (hidden comment: CAP CER 0.1UF 25V X7R 0805)
R31  2.2M  [RESC0402(1005)_M]
R32  100  [RESC0402(1005)_M]
R33  100  [RESC0402(1005)_M]
R34  475K  [RESC0402(1005)_M]
R35  10k  [RESC0402(1005)_M]
R36  47.5K  [RESC0402(1005)_M]
R37  301K  [RESC0402(1005)_M]
U15  OPA2188AIDR  [D0008A_L]  (parts A,B of 2)

### Ports
BEAM_IN, BEAM_OUT, GUARD

### Nets
GND: C28.1 R31.2 R34.2 R35.2 R36.2 U15.4(V-)
ZP: C28.2 U15.8(V+)
NetC26_1: C26.1 R33.1 U15.6(IN_B-) U15.7(OUT_B)
NetC26_2: C26.2 R34.1 U15.3(IN_A+)
NetC27_1: C27.1 R36.1 ; port BEAM_OUT
NetC27_2: C27.2 R37.1 U15.1(OUT_A)
NetR31_1: R31.1 R32.1 U15.5(IN_B+)
NetR32_2: R32.2 ; port BEAM_IN
NetR33_2: R33.2 ; port GUARD
NetR35_1: R35.1 R37.2 U15.2(IN_A-)

### Notes on the sheet
- Title
- Size:
- Date:
- Orcad A
- Number:
- Time:
- Revision:
- Sheet
- of
- ZLS Corporation
- 7801 North Lamar Blvd.
- Suite E-184
- Austin, Texas 78752  USA
- (512) 453-0288
- File:

### Library data of the parts
C26-C28 = CMP-1036-04795-1: as C22 on sheet Sheet1; Supplier 1: Digi-Key; Supplier Part Number 1: 490-1673-6-ND; RoHS: RoHS Compliant; Category: Capacitors; Stock 1: 891652; Pricing 1: 1=0.2, 10=0.145, 100=0.0683, 500=0.04788, 1000=0.03964 (USD); Packaging: Digi-Reel®; Part Status: Active; Voltage - Rated: 25V; Temperature Coefficient: X7R; Operating Temperature: -55°C ~ 125°C; Features: -; Ratings: -; Applications: General Purpose; Mounting Type: Surface Mount, MLCC; Package / Case: 0805 (2012 Metric); Size / Dimension: 0.079" L x 0.049" W (2.00mm x 1.25mm); Height - Seated (Max): -; Thickness (Max): 0.053" (1.35mm); Lead Spacing: -; Lead Style: -; ComponentLink1URL: http://www.murata.com/~/media/webrenewal/support/library/catalog/products/capacitor/mlcc/c02e.ashx; ComponentLink1Description: http://www.murata.com/~/media/webrenewal/support/library/catalog/products/capacitor/mlcc/c02e.ashx
R31-R37 = CMP-1011-00651-1: as R18 on sheet Sheet2; Supplier Part Number 1: CRCW0402100KFKEDHP/BKN; Case/Package: 0402; Case Code (Metric): 1005; Case Code (Imperial): 0402; Contact Plating: Tin; Composition: Thick Film; Length: 1mm; Height: 0.3mm; Depth: 0.5mm; Lead Free: Lead Free; ComponentLink1URL: https://datasheet.ciiva.com/8982/crcwhpe3-8982553.pdf; ComponentLink1Description: https://datasheet.ciiva.com/8982/crcwhpe3-8982553.pdf; ComponentLink2URL: https://datasheet.ciiva.com/2498/crcwhpe3-2498716.pdf; ComponentLink2Description: https://datasheet.ciiva.com/2498/crcwhpe3-2498716.pdf; ComponentLink3URL: https://datasheet.ciiva.com/2498/crcwhpe3-2498717.pdf; ComponentLink3Description: https://datasheet.ciiva.com/2498/crcwhpe3-2498717.pdf; ComponentLink4URL: https://datasheet.ciiva.com/5548/crcwhpe3-46056-5548557.pdf; ComponentLink4Description: https://datasheet.ciiva.com/5548/crcwhpe3-46056-5548557.pdf; ComponentLink5URL: https://datasheet.ciiva.com/2498/crcwhpe3-2498718.pdf; ComponentLink5Description: https://datasheet.ciiva.com/2498/crcwhpe3-2498718.pdf; ComponentLink6URL: https://datasheet.ciiva.com/48525/crcwhpe3-48525582.pdf; ComponentLink6Description: https://datasheet.ciiva.com/48525/crcwhpe3-48525582.pdf; ComponentLink7URL: https://datasheet.ciiva.com/46441/1703058-46441599.pdf; ComponentLink7Description: https://datasheet.ciiva.com/46441/1703058-46441599.pdf
U15 = CMP-0272-00241-3: as U4 on sheet Sheet1; Supplier 1: Digi-Key; Supplier Part Number 1: 296-29454-6-ND; Manufacturer Part Number: OPA2188AIDR; RoHS: RoHS Compliant; Category: Integrated Circuits (ICs); Stock 1: 8272; Pricing 1: 1=3.44, 10=3.089, 100=2.5307, 500=2.15434, 1000=1.81692 (USD); Packaging: Digi-Reel®; Part Status: Active; Amplifier Type: Zero-Drift; Output Type: Rail-to-Rail; -3db Bandwidth: -; Operating Temperature: -40°C ~ 105°C; Mounting Type: Surface Mount; Package / Case: 8-SOIC (0.154", 3.90mm Width); Supplier Device Package: 8-SOIC; ComponentLink1URL: http://www.ti.com/lit/ds/symlink/opa2188.pdf; ComponentLink1Description: http://www.ti.com/lit/ds/symlink/opa2188.pdf

## Nets that join several sheets
+3.3: Sheet1 (P7.6), Sheet2 (C20.1 U10.3)
+5: Sheet1 (9 pins), Sheet2 (10 pins)
GND: Sheet1 (33 pins), Sheet2 (17 pins), Sheet3 (16 pins), Sheet4 (6 pins)
ZH: Sheet1 (5 pins), Sheet2 (R20.2), Sheet3 (U14.12 U14.17)
ZP: Sheet1 (C7.1 P4.3 P5.7 U2.8), Sheet2 (R22.2), Sheet3 (C24.2 C25.2 U13.8 U14.16), Sheet4 (C28.2 U15.8)
Beam Sync Demod Out: Sheet1 (C4.2 P2.2 R2.1 R4.2), Sheet2 (R18.2)
NetP7_3: Sheet1 (P7.3), Sheet2 (U9.14)
NetP7_5: Sheet1 (P7.5), Sheet2 (U9.1)
NetP7_7: Sheet1 (P7.7), Sheet2 (U10.1)
NetP7_9: Sheet1 (P7.9 U?.14), Sheet2 (U10.10)
NetP7_10: Sheet1 (P7.10), Sheet2 (U10.9)